# Altium schematic sheet Fleet-Monitor-Ethernet-Filter.SchDoc: Fleet Monitor
size A4; Subtitle: Ethernet Isolator; DocumentNumber: 6; Revision: V1.0; SheetNumber: 7; SheetTotal: 8; Author: Florian Baumgartner & Luca Jost
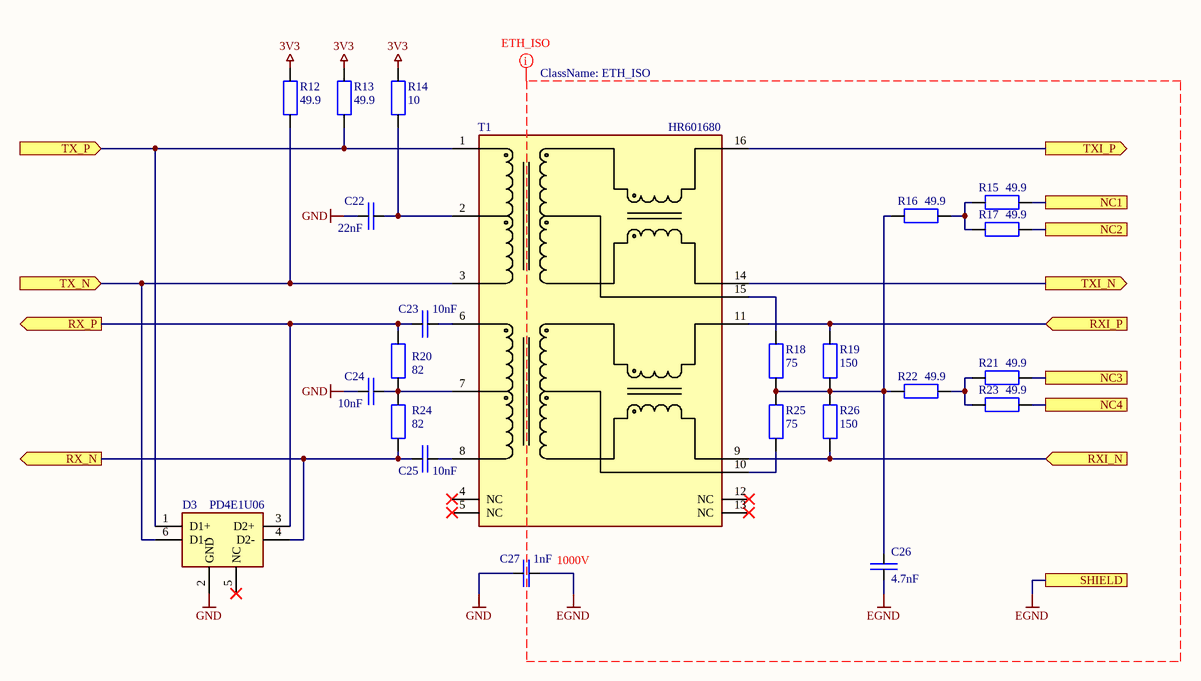
[diagram p0: Fleet-Monitor-Ethernet-Filter.SchDoc]

## Parts
C22  22nF  [SMD Keramikkondensator 0603]
C23  10nF  [SMD Keramikkondensator 0603]
C24  10nF  [SMD Keramikkondensator 0603]
C25  10nF  [SMD Keramikkondensator 0603]
C26  4.7nF  [SMD Keramikkondensator 0603]
C27  1nF  [SMD Keramikkondensator 1808]
D3  PD4E1U06  [SMD IC SOT-363 (SC-70-6)]
R12  49.9  [SMD Widerstand 0603]
R13  49.9  [SMD Widerstand 0603]
R14  10  [SMD Widerstand 0603]
R15  49.9  [SMD Widerstand 0603]
R16  49.9  [SMD Widerstand 0603]
R17  49.9  [SMD Widerstand 0603]
R18  75  [SMD Widerstand 0603]
R19  150  [SMD Widerstand 0603]
R20  82  [SMD Widerstand 0603]
R21  49.9  [SMD Widerstand 0603]
R22  49.9  [SMD Widerstand 0603]
R23  49.9  [SMD Widerstand 0603]
R24  82  [SMD Widerstand 0603]
R25  75  [SMD Widerstand 0603]
R26  150  [SMD Widerstand 0603]
T1  HR601680  [SMD Transformer 500x375]

## Ports
NC1, NC2, NC3, NC4, RX_N (out), RX_P (out), RXI_N (in), RXI_P (in), SHIELD, TX_N (in), TX_P (in), TXI_N (out), TXI_P (out)

## Nets
3V3: R12.2 R13.2 R14.2
EGND: C26.1 C27.2 ; port SHIELD
GND: C22.2 C24.2 C27.1 D3.2(GND)
NC1: R15.1 ; port NC1
NC2: R17.1 ; port NC2
NC3: R21.1 ; port NC3
NC4: R23.1 ; port NC4
RX_N: C25.1 D3.4(D2-) R24.1 ; port RX_N
RX_P: C23.1 D3.3(D2+) R20.2 ; port RX_P
RXI_N: R26.1 T1.9(RX-) ; port RXI_N
RXI_P: R19.2 T1.11(RX+) ; port RXI_P
TX_N: D3.6(D1-) R12.1 T1.3(TD-) ; port TX_N
TX_P: D3.1(D1+) R13.1 T1.1(TD+) ; port TX_P
TXI_N: T1.14(TX-) ; port TXI_N
TXI_P: T1.16(TX+) ; port TXI_P
NetC22_1: C22.1 R14.1 T1.2(CT)
NetC23_2: C23.2 T1.6(RD+)
NetC24_1: C24.1 R20.1 R24.2 T1.7(CT)
NetC25_2: C25.2 T1.8(RD-)
NetC26_2: C26.2 R16.2 R18.1 R19.1 R22.2 R25.2 R26.2
NetR15_2: R15.2 R16.1 R17.2
NetR18_2: R18.2 T1.15(NC)
NetR21_2: R21.2 R22.1 R23.2
NetR25_1: R25.1 T1.10(NC)

Not connected (* = marked no-connect by the designer): D3 5(NC)*; T1 4(NC)* 5(NC)* 12(NC)* 13(NC)*

## Layout directives
net class ETH_ISO: EGND

## Notes on the sheet
- 1000V
- Title
- Author:
- Subtitle
- Date:
- Rev:
- File:
- Sheet
- of

## Library data of the parts
C22 = E6 - 22nF: SMD Ceramic Capacitor E6; Component Value: 22nF 50V; Description: Multilayer Ceramic Capacitors MLCC; ComponentLink1Description: Datasheet; ComponentLink1URL: https://datasheet.lcsc.com/lcsc/1811101610_Samsung-Electro-Mechanics-CL10B223KB8NNNC_C21122.pdf; Digikey: 1276-1104-1-ND; Farnell: 3013425; JLC-Parts: C21122; Mouser: 187-CL10B223KB8NNNC; Unit Price: 0.01; Component Description: Multilayer Ceramic Capacitors MLCC
C23-C25 = E6 - 10nF: SMD Ceramic Capacitor E6; Component Value: 10nF 50V; Description: Multilayer Ceramic Capacitors MLCC; ComponentLink1Description: Datasheet; ComponentLink1URL: https://datasheet.lcsc.com/lcsc/2102081402_FH-Guangdong-Fenghua-Advanced-Tech-0603B103K500NT_C57112.pdf; Digikey: 478-3700-1-ND; Farnell: 1833876; JLC-Parts: C57112; Mouser: 581-06031C103J; Unit Price: 0.01; Component Description: Multilayer Ceramic Capacitors MLCC
C26 = E6 - 4.7nF: SMD Ceramic Capacitor E6; Component Value: 4.7nF 50V; Description: Multilayer Ceramic Capacitors MLCC; ComponentLink1Description: Datasheet; ComponentLink1URL: https://datasheet.lcsc.com/lcsc/1811061811_FH-Guangdong-Fenghua-Advanced-Tech-0603B472K500NT_C53987.pdf; Digikey: 478-10355-1-ND; Farnell: 2332650; JLC-Parts: C53987; Mouser: 581-06035C472JAT2A; Unit Price: 0.01; Component Description: Multilayer Ceramic Capacitors MLCC
C27 = E6 - 1nF: SMD Ceramic Capacitor E6; Component Value: 1nF 3kV; Description: Multilayer Ceramic Capacitors MLCC; ComponentLink1Description: Datasheet; ComponentLink1URL: https://datasheet.lcsc.com/lcsc/1912111437_Johanson-Dielectrics-302R29W102KV4E_C173224.pdf; Digikey: 709-1047-1-ND; Farnell: 1886070; JLC-Parts: C173224; Mouser: 605-302R29W102KV4E; Unit Price: 0.06; Component Description: Multilayer Ceramic Capacitors MLCC
D3 = PD4E1U06DCKR: Unidirectional 3A (8/20us) 15V (Typ) 6.5V 5.5V (Max) SOT-363 ESD Protection Devices ROHS; Description: ESD Suppressor; ComponentLink1Description: Datasheet; ComponentLink1URL: https://datasheet.lcsc.com/lcsc/1810172210_Texas-Instruments-TPD4E1U06DCKR_C194628.pdf; Component Value: PD4E1U06; Digikey: 296-39347-1-ND; Farnell: 3116516; JLC-Parts: C194628; Mouser: 595-TPD4E1U06DCKR; Unit Price: 0.12; Component Description: ESD Suppressor
R12 R13 R15-R17 R21-R23 = E96 - 49.9: SMD Chip Resistor E96; Component Value: 49.9 (75V, 100mW, 1%); Description: Chip Resistor; ComponentLink1Description: Datasheet; ComponentLink1URL: https://datasheet.lcsc.com/lcsc/1810200710_UNI-ROYAL-Uniroyal-Elec-0603WAF4701T5E_C23162.pdf; Digikey: P49.9HCT-ND; Farnell: 2059274; JLC-Parts: C23184; Mouser: 667-ERJ-3EKF49R9V; Unit Price: 0.01; Component Description: Chip Resistor
R14 = E24 - 10: SMD Chip Resistor E24; Component Value: 10 (75V, 100mW, 1%); Description: Chip Resistor; ComponentLink1Description: Datasheet; ComponentLink1URL: https://datasheet.lcsc.com/lcsc/1810200710_UNI-ROYAL-Uniroyal-Elec-0603WAF4701T5E_C23162.pdf; Digikey: P10.0HCT-ND; Farnell: 2302958; JLC-Parts: C22859; Mouser: 667-ERJ-3EKF10R0V; Unit Price: 0.01; Component Description: Chip Resistor
R18 R25 = E24 - 75: SMD Chip Resistor E24; Component Value: 75 (75V, 100mW, 1%); Description: Chip Resistor; ComponentLink1Description: Datasheet; ComponentLink1URL: https://datasheet.lcsc.com/lcsc/1810200710_UNI-ROYAL-Uniroyal-Elec-0603WAF4701T5E_C23162.pdf; Digikey: P75.0HCT-ND; Farnell: 2059282; JLC-Parts: C4275; Mouser: 667-ERJ-3EKF75R0V; Unit Price: 0.01; Component Description: Chip Resistor
R19 R26 = E24 - 150: SMD Chip Resistor E24; Component Value: 150 (75V, 100mW, 1%); Description: Chip Resistor; ComponentLink1Description: Datasheet; ComponentLink1URL: https://datasheet.lcsc.com/lcsc/1810200710_UNI-ROYAL-Uniroyal-Elec-0603WAF4701T5E_C23162.pdf; Digikey: P150HCT-ND; Farnell: 2303076; JLC-Parts: C22808; Mouser: 667-ERJ-3EKF1500V; Unit Price: 0.01; Component Description: Chip Resistor
R20 R24 = E24 - 82: SMD Chip Resistor E24; Component Value: 82 (75V, 100mW, 1%); Description: Chip Resistor; ComponentLink1Description: Datasheet; ComponentLink1URL: https://datasheet.lcsc.com/lcsc/1810200710_UNI-ROYAL-Uniroyal-Elec-0603WAF4701T5E_C23162.pdf; Digikey: P82.0HCT-ND; Farnell: 2303052; JLC-Parts: C23255; Mouser: 667-ERJ-3EKF82R0V; Unit Price: 0.01; Component Description: Chip Resistor
T1 = HR601680: LAN 10/100 Base-T Pulse Transformer 1CT:1CT Transmitter, 1CT:1CT Receiver Surface Mount; Component Description: RJ45 Transformer; ComponentLink1Description: Datasheet; ComponentLink1URL: https://datasheet.lcsc.com/lcsc/1810041709_HANRUN-Zhongshan-HanRun-Elec-HR601680_C172799.pdf; Component Value: HR601680; Digikey: SM13072APELCT-ND; Farnell: 2673883; JLC-Parts: C172799; Mouser: 652-SM13072APEL; Unit Price: 0.57